# EAGLE design Platine_2_smd (EAGLE 9.6.2)

## Sheet 1 of 2
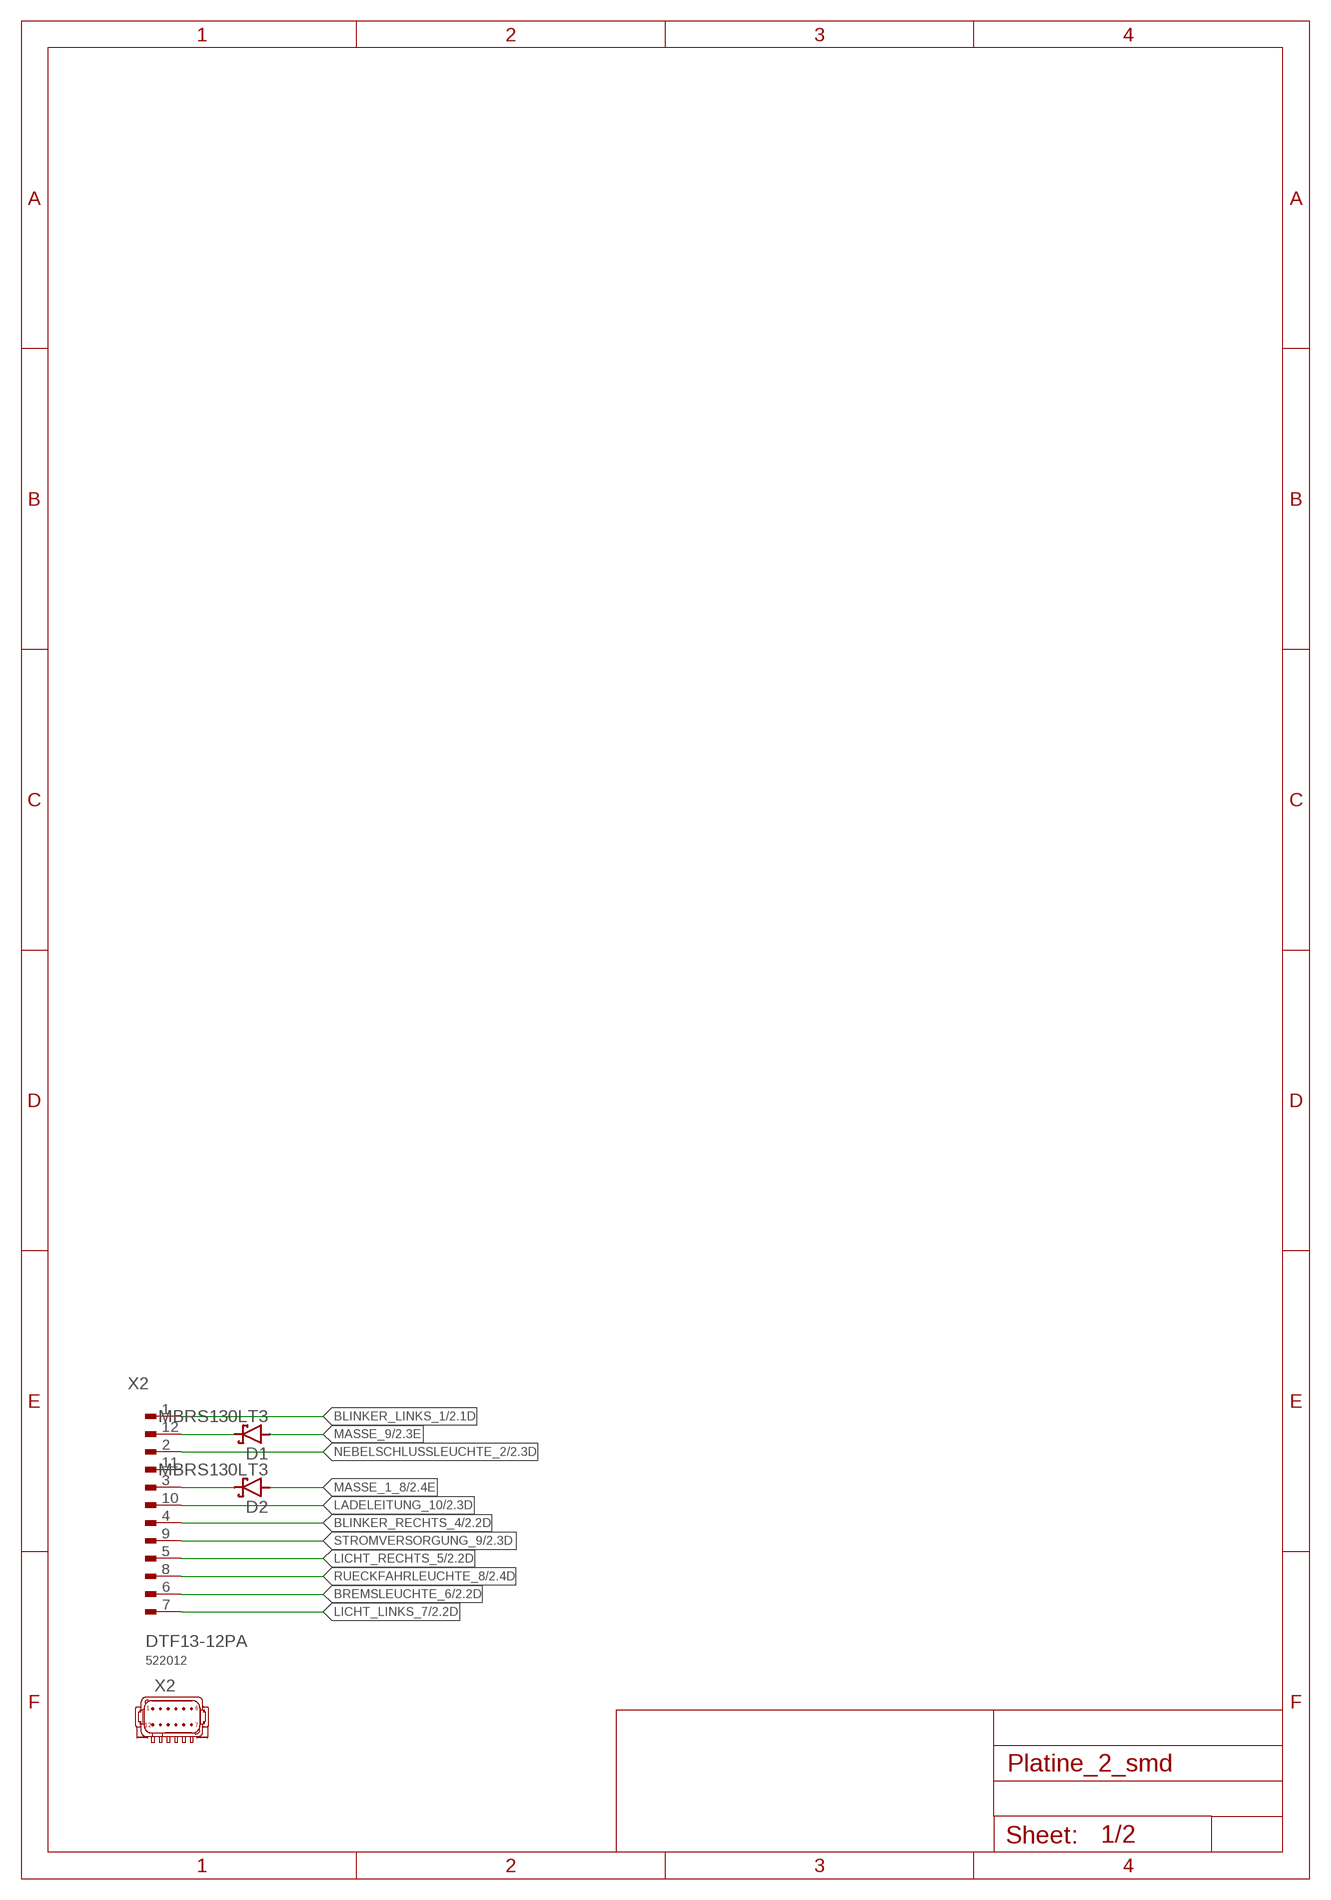
[diagram p0: schematic, sheet 1]

### Parts
D1  MBRS130LT3  [SMB]
D2  MBRS130LT3  [SMB]
X2  DTF13-12PA  [DTF13-12PA]

### Nets
BLINKER_LINKS_1: X2.1 ; also sheet 2
BLINKER_RECHTS_4: X2.4 ; also sheet 2
BREMSLEUCHTE_6: X2.6 ; also sheet 2
LADELEITUNG_10: X2.10 ; also sheet 2
LICHT_LINKS_7: X2.7 ; also sheet 2
LICHT_RECHTS_5: X2.5 ; also sheet 2
MASSE_1_8: D2.A ; also sheet 2
MASSE_9: D1.A ; also sheet 2
N$10: D1.C X2.12
N$11: D2.C X2.3
NEBELSCHLUSSLEUCHTE_2: X2.2 ; also sheet 2
RUECKFAHRLEUCHTE_8: X2.8 ; also sheet 2
STROMVERSORGUNG_9: X2.9 ; also sheet 2
Unconnected: X2.11

## Sheet 2 of 2
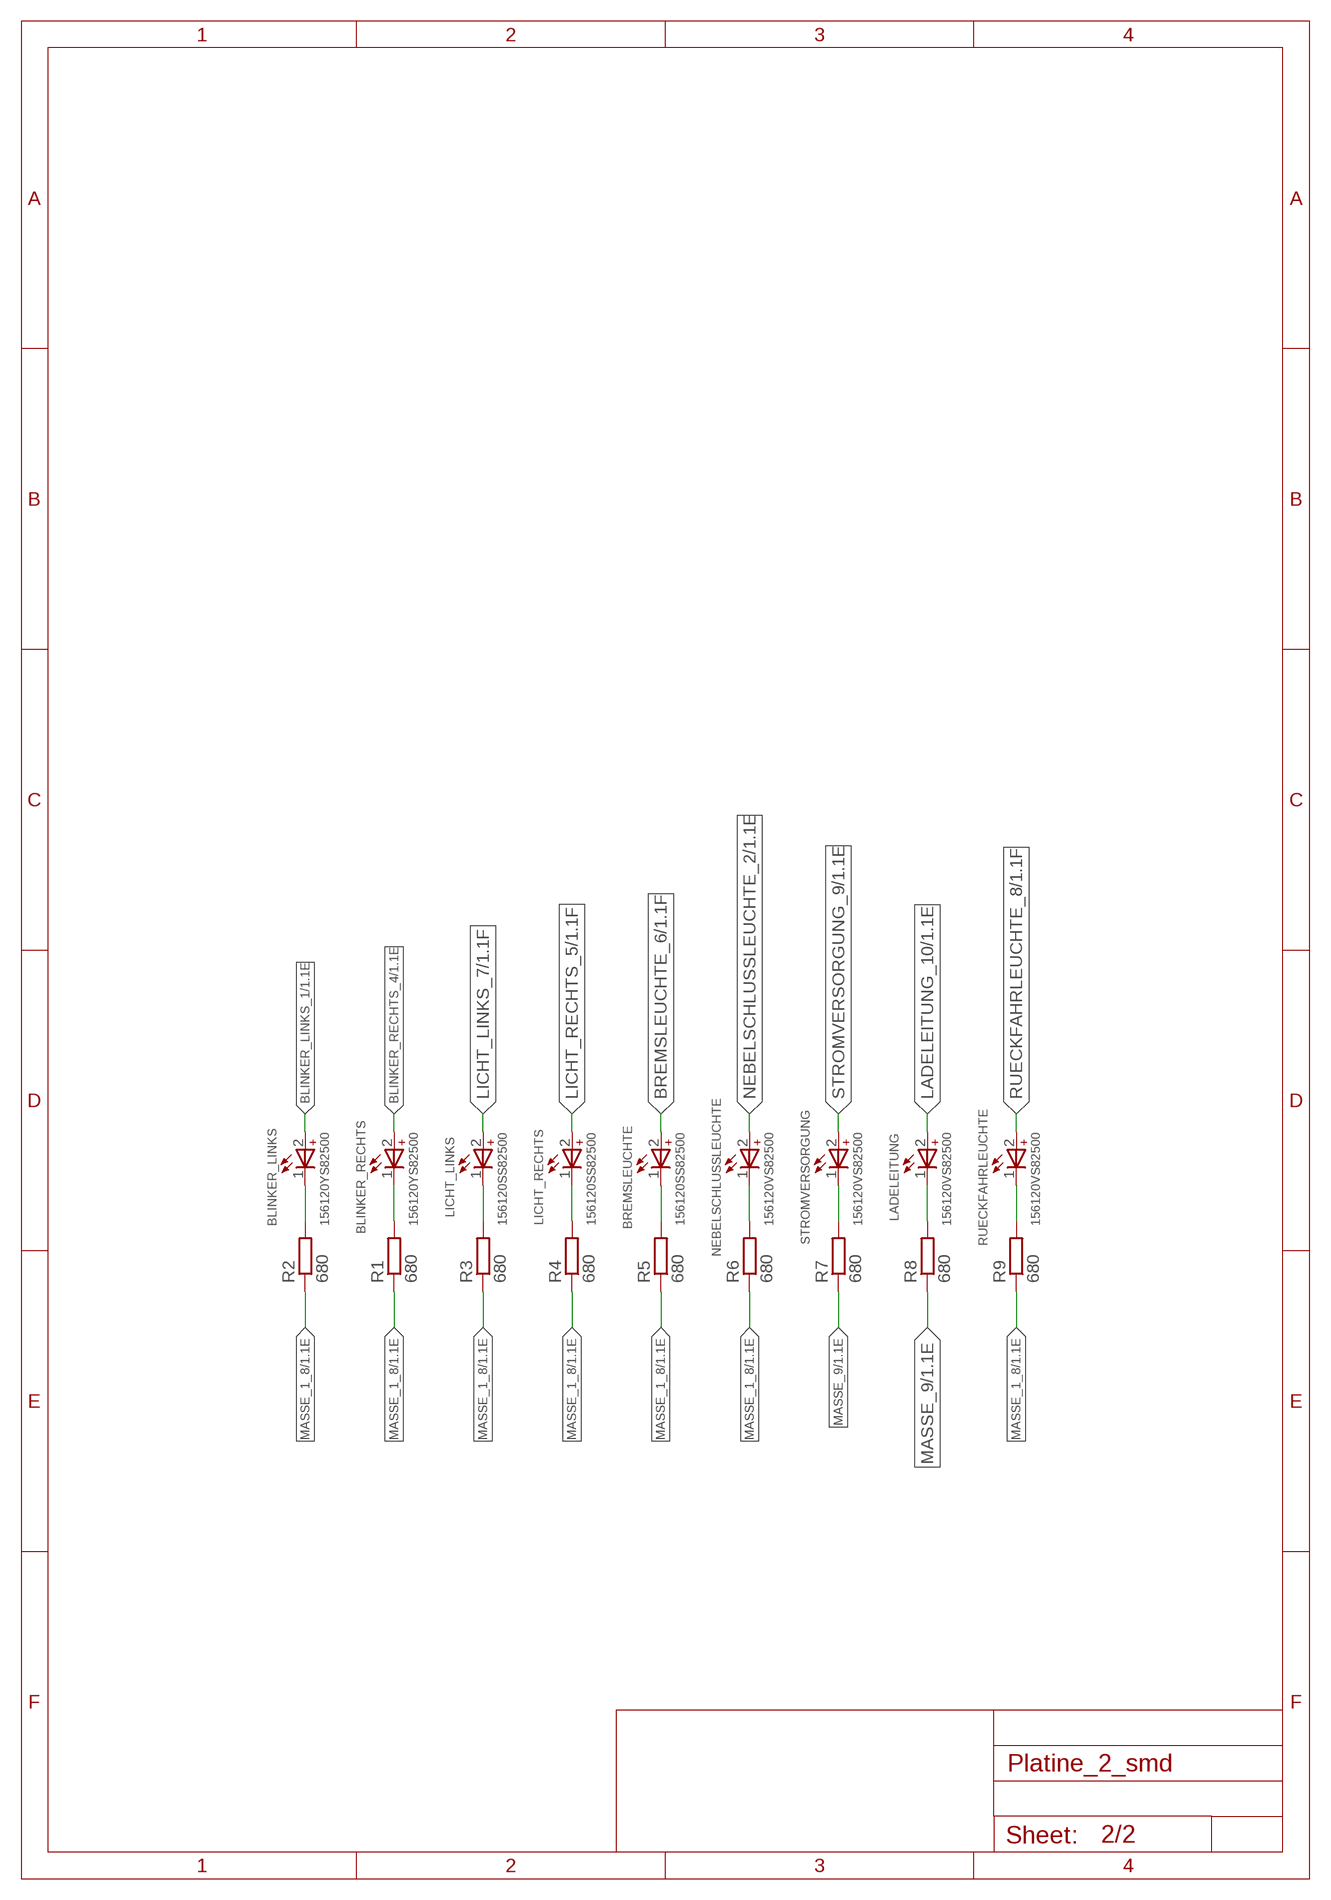
[diagram p1: schematic, sheet 2]

### Parts
BLINKER_LINKS  156120YS82500  WL-SMRW_1206_DOME_156120YS82500_REV  [WL-SMRW_1206_DOME_REV]
BLINKER_RECHTS  156120YS82500  WL-SMRW_1206_DOME_156120YS82500_REV  [WL-SMRW_1206_DOME_REV]
BREMSLEUCHTE  156120SS82500  WL-SMRW_1206_DOME_156120SS82500_REV  [WL-SMRW_1206_DOME_REV]
LADELEITUNG  156120VS82500  WL-SMRW_1206_DOME_156120SS82500_REV  [WL-SMRW_1206_DOME_REV]
LICHT_LINKS  156120SS82500  WL-SMRW_1206_DOME_156120SS82500_REV  [WL-SMRW_1206_DOME_REV]
LICHT_RECHTS  156120SS82500  WL-SMRW_1206_DOME_156120SS82500_REV  [WL-SMRW_1206_DOME_REV]
NEBELSCHLUSSLEUCHTE  156120VS82500  WL-SMRW_1206_DOME_156120SS82500_REV  [WL-SMRW_1206_DOME_REV]
R1  680  R-EU_R1206  [R1206]
R2  680  R-EU_R1206  [R1206]
R3  680  R-EU_R1206  [R1206]
R4  680  R-EU_R1206  [R1206]
R5  680  R-EU_R1206  [R1206]
R6  680  R-EU_R1206  [R1206]
R7  680  R-EU_R1206  [R1206]
R8  680  R-EU_R1206  [R1206]
R9  680  R-EU_R1206  [R1206]
RUECKFAHRLEUCHTE  156120VS82500  WL-SMRW_1206_DOME_156120SS82500_REV  [WL-SMRW_1206_DOME_REV]
STROMVERSORGUNG  156120VS82500  WL-SMRW_1206_DOME_156120SS82500_REV  [WL-SMRW_1206_DOME_REV]

### Nets
BLINKER_LINKS_1: BLINKER_LINKS.2(+) ; also sheet 1
BLINKER_RECHTS_4: BLINKER_RECHTS.2(+) ; also sheet 1
BREMSLEUCHTE_6: BREMSLEUCHTE.2(+) ; also sheet 1
LADELEITUNG_10: LADELEITUNG.2(+) ; also sheet 1
LICHT_LINKS_7: LICHT_LINKS.2(+) ; also sheet 1
LICHT_RECHTS_5: LICHT_RECHTS.2(+) ; also sheet 1
MASSE_1_8: R1.1 R2.1 R3.1 R4.1 R5.1 R6.1 R9.1 ; also sheet 1
MASSE_9: R7.1 R8.1 ; also sheet 1
N$1: LICHT_LINKS.1(-) R3.2
N$2: LICHT_RECHTS.1(-) R4.2
N$3: BLINKER_LINKS.1(-) R2.2
N$4: BREMSLEUCHTE.1(-) R5.2
N$5: BLINKER_RECHTS.1(-) R1.2
N$6: NEBELSCHLUSSLEUCHTE.1(-) R6.2
N$7: R7.2 STROMVERSORGUNG.1(-)
N$8: LADELEITUNG.1(-) R8.2
N$9: R9.2 RUECKFAHRLEUCHTE.1(-)
NEBELSCHLUSSLEUCHTE_2: NEBELSCHLUSSLEUCHTE.2(+) ; also sheet 1
RUECKFAHRLEUCHTE_8: RUECKFAHRLEUCHTE.2(+) ; also sheet 1
STROMVERSORGUNG_9: STROMVERSORGUNG.2(+) ; also sheet 1

## Library data of the parts
BLINKER_LINKS BLINKER_RECHTS = Wurth_LEDs_WL-SMRW:WL-SMRW_1206_DOME: WL-SMRW SMD Mono-color Reverse mount Waterclear Characteristics Small size & thin body for space saving Ideal for narrow space applications Wide viewing angle Low power consumption Industry standard footprint Small LED package for exceptional brightness To emit light through a small cut-out hole in PCB Compatible with automatic placement machine Applications Front panels indicators LCD backlighting Keypad backlighting Push button backlighting Symbol and switch backlighting General LED lighting <https://www.we-online.com/catalog/media/o35733v209%20Family_WL-SMRW_neu.jpg> Details see: www.we-online.com/catalog/WL-SMRW <www.we-online.com/catalog/WL-SMRW/?utm_source=eagle_model&utm_medium=description_link&utm_campaign=eisos_eagle> Updated By Ella Wu 2022-06-20 2022 (C) Wurth Elektronik; CHIP-TECHNOLOGY: AlInGaP; DATASHEET-URL: https://www.we-online.com/redexpert/spec/156120YS82500?ae; DOMINANT-WAVELENGTH: 589nm; EMITTING-COLOR: Yellow; FORWARD-VOLTAGE: 2V; LUMINOUS-INTENSITY: 1400mcd; PART-NUMBER: 156120YS82500; PEAK-WAVELENGTH: 591nm; VIEWING-ANGLE: 20°
BREMSLEUCHTE LICHT_LINKS LICHT_RECHTS = Wurth_LEDs_WL-SMRW:WL-SMRW_1206_DOME: WL-SMRW SMD Mono-color Reverse mount Waterclear Characteristics Small size & thin body for space saving Ideal for narrow space applications Wide viewing angle Low power consumption Industry standard footprint Small LED package for exceptional brightness To emit light through a small cut-out hole in PCB Compatible with automatic placement machine Applications Front panels indicators LCD backlighting Keypad backlighting Push button backlighting Symbol and switch backlighting General LED lighting <https://www.we-online.com/catalog/media/o35733v209%20Family_WL-SMRW_neu.jpg> Details see: www.we-online.com/catalog/WL-SMRW <www.we-online.com/catalog/WL-SMRW/?utm_source=eagle_model&utm_medium=description_link&utm_campaign=eisos_eagle> Updated By Ella Wu 2022-06-20 2022 (C) Wurth Elektronik; CHIP-TECHNOLOGY: AlInGaP; DATASHEET-URL: https://www.we-online.com/redexpert/spec/156120SS82500?ae; DOMINANT-WAVELENGTH: 630nm; EMITTING-COLOR: Super Red; FORWARD-VOLTAGE: 2V; LUMINOUS-INTENSITY: 900mcd; PART-NUMBER: 156120SS82500; PEAK-WAVELENGTH: 645nm; VIEWING-ANGLE: 20°
D1 D2 = diode:MBRS130LT3: Schottky Power Rectifier Source: http://www.onsemi.com/pub/Collateral/MBRS130LT3-D.PDF
LADELEITUNG NEBELSCHLUSSLEUCHTE RUECKFAHRLEUCHTE STROMVERSORGUNG = Wurth_LEDs_WL-SMRW:WL-SMRW_1206_DOME: WL-SMRW SMD Mono-color Reverse mount Waterclear Characteristics Small size & thin body for space saving Ideal for narrow space applications Wide viewing angle Low power consumption Industry standard footprint Small LED package for exceptional brightness To emit light through a small cut-out hole in PCB Compatible with automatic placement machine Applications Front panels indicators LCD backlighting Keypad backlighting Push button backlighting Symbol and switch backlighting General LED lighting <https://www.we-online.com/catalog/media/o35733v209%20Family_WL-SMRW_neu.jpg> Details see: www.we-online.com/catalog/WL-SMRW <www.we-online.com/catalog/WL-SMRW/?utm_source=eagle_model&utm_medium=description_link&utm_campaign=eisos_eagle> Updated By Ella Wu 2022-06-20 2022 (C) Wurth Elektronik; CHIP-TECHNOLOGY: AlInGaP; DATASHEET-URL: https://www.we-online.com/redexpert/spec/156120SS82500?ae; DOMINANT-WAVELENGTH: 630nm; EMITTING-COLOR: Super Red; FORWARD-VOLTAGE: 2V; LUMINOUS-INTENSITY: 900mcd; PART-NUMBER: 156120SS82500; PEAK-WAVELENGTH: 645nm; VALUE: 156120SS82500; VIEWING-ANGLE: 20°
R1-R9 = rcl:R-EU_: RESISTOR, European symbol; SPICEPREFIX: R
X2 = DEUTSCH-PCB:DTF13-12PA: DTF13-12PA Connector System : Draht-an-Leiterplatte, Kabel-an-Gerät Alias NummerZPF000000000130557 Home-Page <http://www.te.com/deu-de/product-DTF13-12PA.html>; ARTIKEL_NR: 522012

## Board
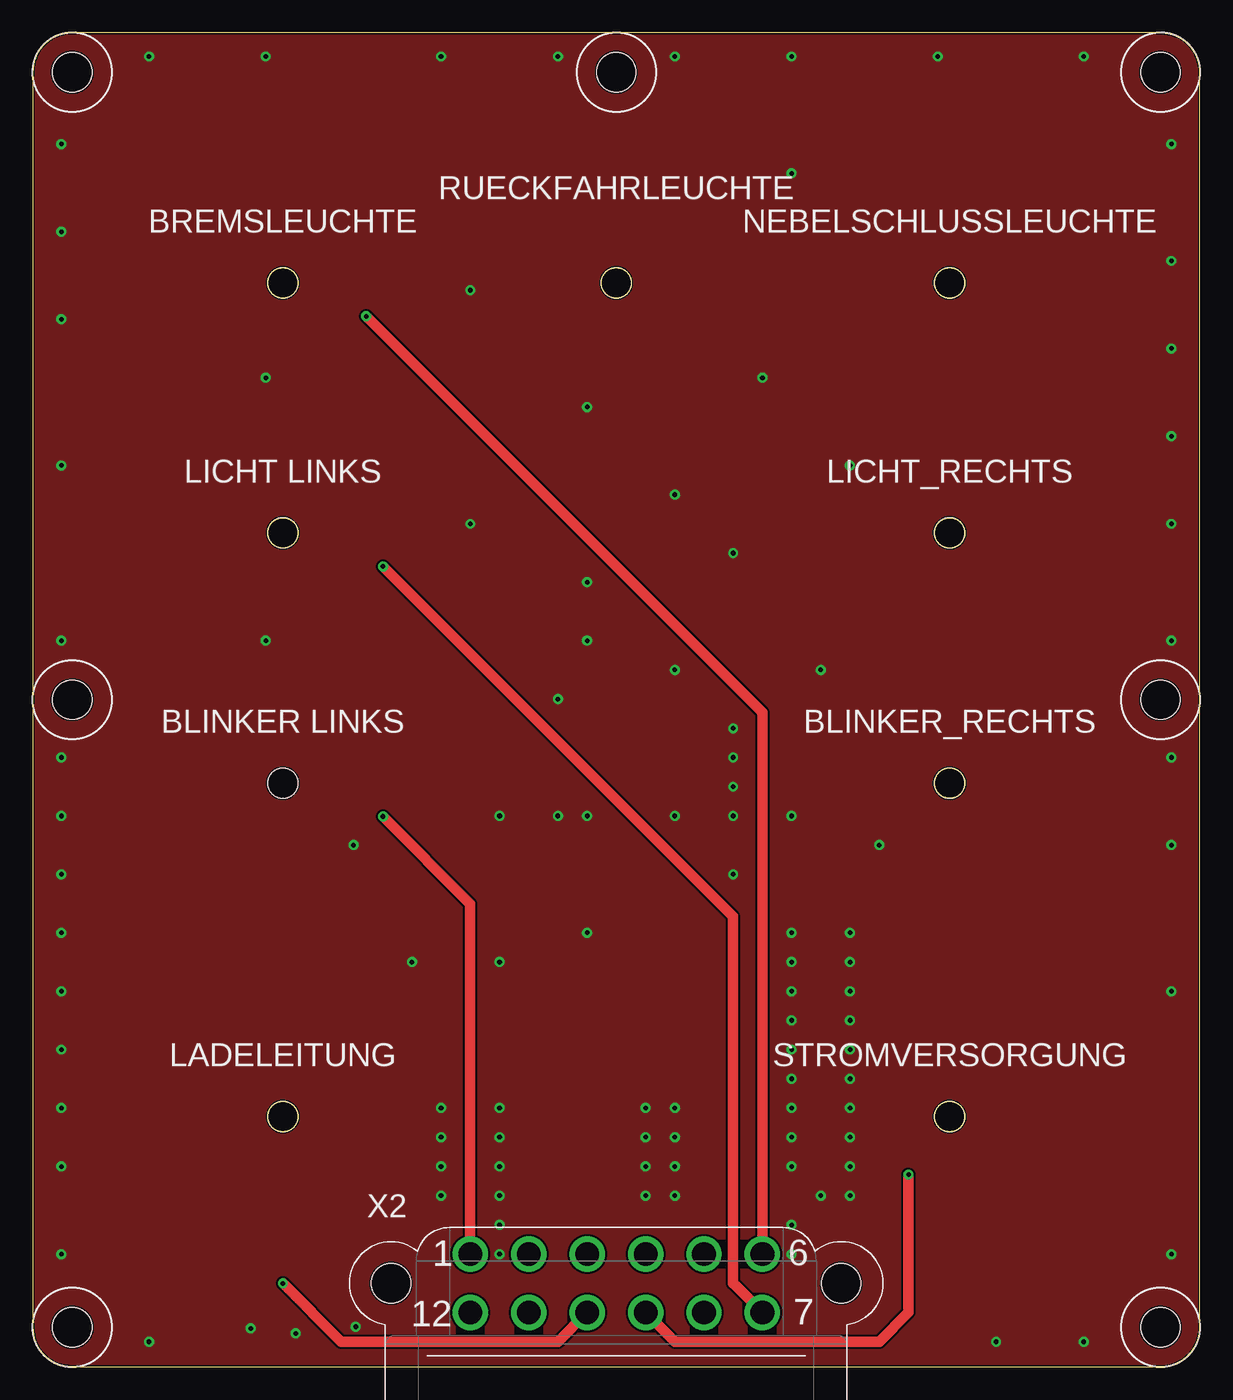
[diagram p2: board, top side]
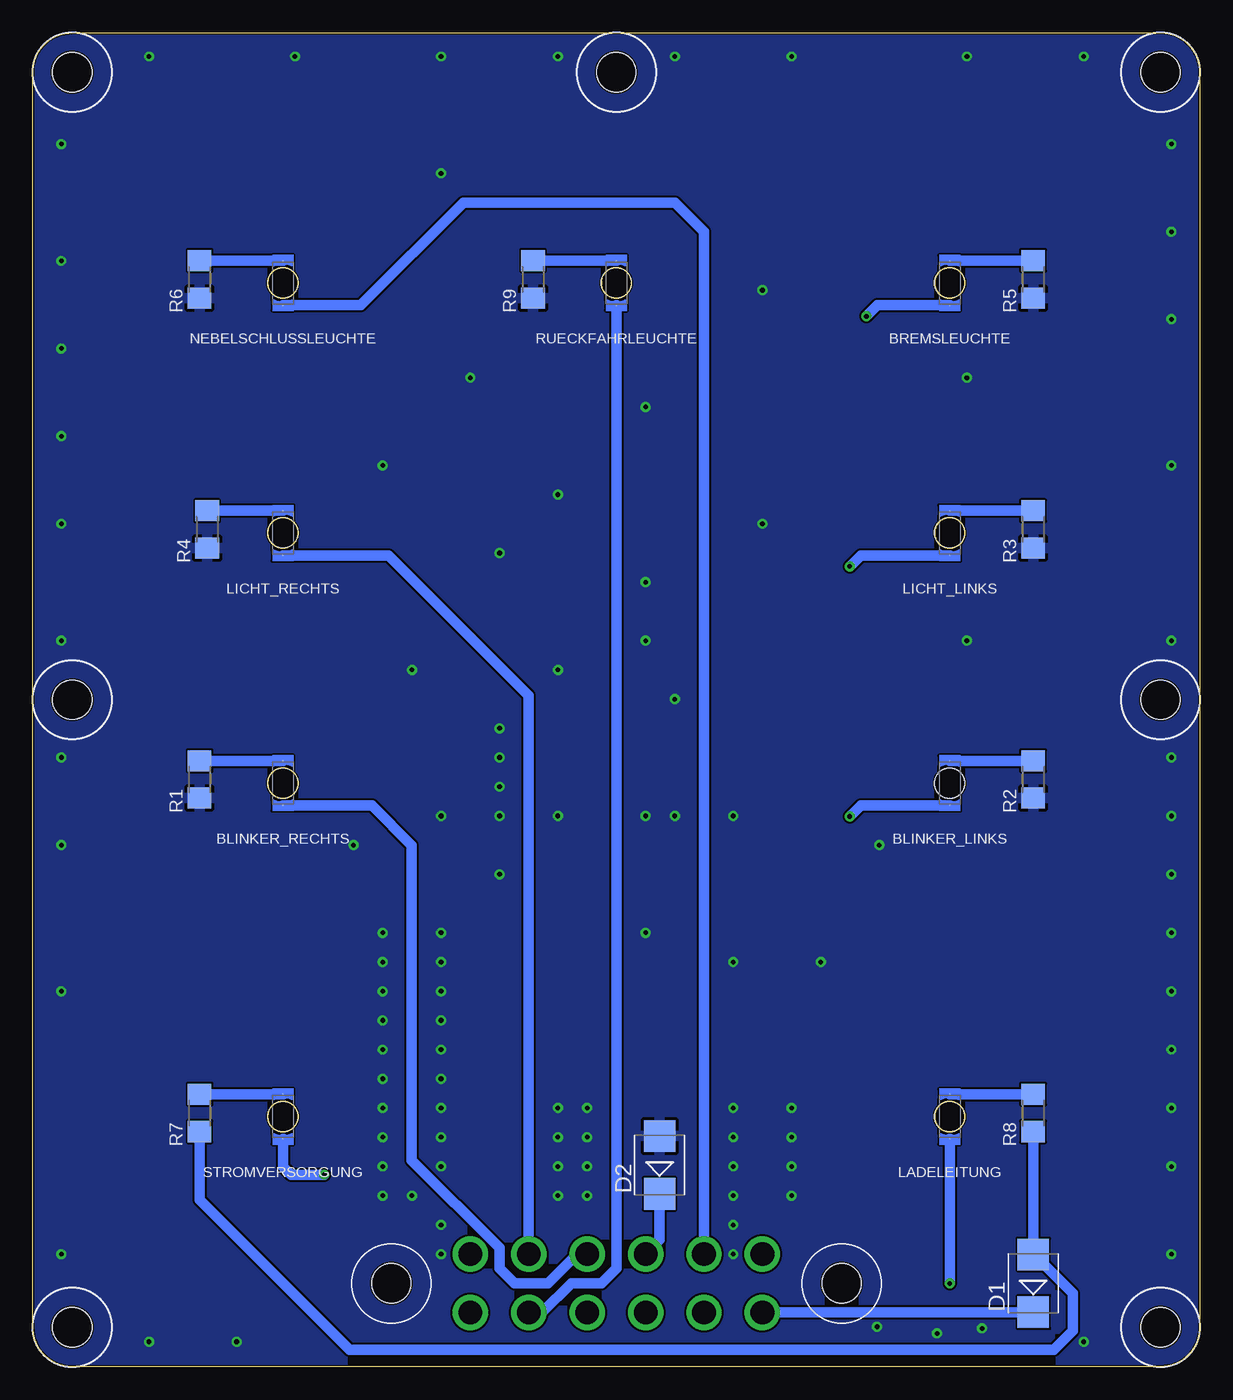
[diagram p3: board, bottom side, seen from below]

Size 88.9 x 101.6 mm. Coordinates in mm from the lower left corner, seen from the top.
Outline: 69.9,81.4 69.81,81.4 69.72,81.41 69.62,81.42 69.54,81.44 69.45,81.47 69.37,81.5 69.29,81.55 69.21,81.59 69.14,81.65 69.07,81.7 69,81.77 68.95,81.84 68.89,81.91 68.85,81.99 68.81,82.07 68.77,82.15 68.74,82.24 68.72,82.32 68.71,82.41 68.7,82.5 68.7,82.59 68.71,82.68 68.72,82.77 68.74,82.86 68.77,82.95 68.81,83.03 68.85,83.11 68.89,83.19 68.95,83.26 69,83.33 69.07,83.39 69.14,83.45 69.21,83.51 69.29,83.55 69.37,83.59 69.45,83.63 69.54,83.66 69.62,83.68 69.72,83.69 69.81,83.7 69.9,83.7 69.98,83.69 70.08,83.68 70.16,83.66 70.25,83.63 70.33,83.59 70.41,83.55 70.49,83.51 70.56,83.45 70.63,83.39 70.7,83.33 70.75,83.26 70.81,83.19 70.85,83.11 70.9,83.03 70.93,82.95 70.96,82.86 70.98,82.77 70.99,82.68 71,82.59 71,82.5 70.99,82.41 70.98,82.32 70.96,82.24 70.93,82.15 70.9,82.07 70.85,81.99 70.81,81.91 70.75,81.84 70.7,81.77 70.63,81.7 70.56,81.65 70.49,81.59 70.41,81.55 70.33,81.5 70.25,81.47 70.16,81.44 70.08,81.42 69.98,81.41 69.9,81.4
Outline: 69.9,43.3 69.81,43.3 69.72,43.31 69.62,43.32 69.54,43.34 69.45,43.37 69.37,43.41 69.29,43.45 69.21,43.49 69.14,43.55 69.07,43.61 69,43.67 68.95,43.74 68.89,43.81 68.85,43.89 68.81,43.97 68.77,44.05 68.74,44.14 68.72,44.23 68.71,44.32 68.7,44.41 68.7,44.5 68.71,44.59 68.72,44.68 68.74,44.76 68.77,44.85 68.81,44.93 68.85,45.01 68.89,45.09 68.95,45.16 69,45.23 69.07,45.3 69.14,45.35 69.21,45.41 69.29,45.45 69.37,45.5 69.45,45.53 69.54,45.56 69.62,45.58 69.72,45.59 69.81,45.6 69.9,45.6 69.98,45.59 70.08,45.58 70.16,45.56 70.25,45.53 70.33,45.5 70.41,45.45 70.49,45.41 70.56,45.35 70.63,45.3 70.7,45.23 70.75,45.16 70.81,45.09 70.85,45.01 70.9,44.93 70.93,44.85 70.96,44.76 70.98,44.68 70.99,44.59 71,44.5 71,44.41 70.99,44.32 70.98,44.23 70.96,44.14 70.93,44.05 70.9,43.97 70.85,43.89 70.81,43.81 70.75,43.74 70.7,43.67 70.63,43.61 70.56,43.55 70.49,43.49 70.41,43.45 70.33,43.41 70.25,43.37 70.16,43.34 70.08,43.32 69.98,43.31 69.9,43.3
Outline: 19.1,17.9 19.01,17.9 18.92,17.91 18.83,17.92 18.74,17.94 18.65,17.97 18.57,18 18.49,18.05 18.41,18.09 18.34,18.15 18.27,18.2 18.21,18.27 18.15,18.34 18.09,18.41 18.05,18.49 18.01,18.57 17.97,18.65 17.94,18.74 17.92,18.83 17.91,18.91 17.9,19 17.9,19.09 17.91,19.19 17.92,19.27 17.94,19.36 17.97,19.45 18.01,19.53 18.05,19.61 18.09,19.69 18.15,19.76 18.21,19.83 18.27,19.89 18.34,19.95 18.41,20.01 18.49,20.05 18.57,20.09 18.65,20.13 18.74,20.16 18.83,20.18 18.92,20.19 19.01,20.2 19.1,20.2 19.19,20.19 19.28,20.18 19.36,20.16 19.45,20.13 19.53,20.09 19.61,20.05 19.69,20.01 19.76,19.95 19.83,19.89 19.9,19.83 19.95,19.76 20.01,19.69 20.05,19.61 20.1,19.53 20.13,19.45 20.16,19.36 20.18,19.27 20.19,19.19 20.2,19.09 20.2,19 20.19,18.91 20.18,18.83 20.16,18.74 20.13,18.65 20.1,18.57 20.05,18.49 20.01,18.41 19.95,18.34 19.9,18.27 19.83,18.2 19.76,18.15 19.69,18.09 19.61,18.05 19.53,18 19.45,17.97 19.36,17.94 19.28,17.92 19.19,17.91 19.1,17.9
Outline: 19.1,81.4 19.01,81.4 18.92,81.41 18.83,81.42 18.74,81.44 18.65,81.47 18.57,81.5 18.49,81.55 18.41,81.59 18.34,81.65 18.27,81.7 18.21,81.77 18.15,81.84 18.09,81.91 18.05,81.99 18.01,82.07 17.97,82.15 17.94,82.24 17.92,82.32 17.91,82.41 17.9,82.5 17.9,82.59 17.91,82.68 17.92,82.77 17.94,82.86 17.97,82.95 18.01,83.03 18.05,83.11 18.09,83.19 18.15,83.26 18.21,83.33 18.27,83.39 18.34,83.45 18.41,83.51 18.49,83.55 18.57,83.59 18.65,83.63 18.74,83.66 18.83,83.68 18.92,83.69 19.01,83.7 19.1,83.7 19.19,83.69 19.28,83.68 19.36,83.66 19.45,83.63 19.53,83.59 19.61,83.55 19.69,83.51 19.76,83.45 19.83,83.39 19.9,83.33 19.95,83.26 20.01,83.19 20.05,83.11 20.1,83.03 20.13,82.95 20.16,82.86 20.18,82.77 20.19,82.68 20.2,82.59 20.2,82.5 20.19,82.41 20.18,82.32 20.16,82.24 20.13,82.15 20.1,82.07 20.05,81.99 20.01,81.91 19.95,81.84 19.9,81.77 19.83,81.7 19.76,81.65 19.69,81.59 19.61,81.55 19.53,81.5 19.45,81.47 19.36,81.44 19.28,81.42 19.19,81.41 19.1,81.4
Outline: 69.9,17.9 69.81,17.9 69.72,17.91 69.62,17.92 69.54,17.94 69.45,17.97 69.37,18 69.29,18.05 69.21,18.09 69.14,18.15 69.07,18.2 69,18.27 68.95,18.34 68.89,18.41 68.85,18.49 68.81,18.57 68.77,18.65 68.74,18.74 68.72,18.83 68.71,18.91 68.7,19 68.7,19.09 68.71,19.19 68.72,19.27 68.74,19.36 68.77,19.45 68.81,19.53 68.85,19.61 68.89,19.69 68.95,19.76 69,19.83 69.07,19.89 69.14,19.95 69.21,20.01 69.29,20.05 69.37,20.09 69.45,20.13 69.54,20.16 69.62,20.18 69.72,20.19 69.81,20.2 69.9,20.2 69.98,20.19 70.08,20.18 70.16,20.16 70.25,20.13 70.33,20.09 70.41,20.05 70.49,20.01 70.56,19.95 70.63,19.89 70.7,19.83 70.75,19.76 70.81,19.69 70.85,19.61 70.9,19.53 70.93,19.45 70.96,19.36 70.98,19.27 70.99,19.19 71,19.09 71,19 70.99,18.91 70.98,18.83 70.96,18.74 70.93,18.65 70.9,18.57 70.85,18.49 70.81,18.41 70.75,18.34 70.7,18.27 70.63,18.2 70.56,18.15 70.49,18.09 70.41,18.05 70.33,18 70.25,17.97 70.16,17.94 70.08,17.92 69.98,17.91 69.9,17.9
Outline: 44.5,81.4 44.41,81.4 44.32,81.41 44.23,81.42 44.14,81.44 44.05,81.47 43.97,81.5 43.89,81.55 43.81,81.59 43.74,81.65 43.67,81.7 43.61,81.77 43.55,81.84 43.49,81.91 43.45,81.99 43.41,82.07 43.37,82.15 43.34,82.24 43.32,82.32 43.31,82.41 43.3,82.5 43.3,82.59 43.31,82.68 43.32,82.77 43.34,82.86 43.37,82.95 43.41,83.03 43.45,83.11 43.49,83.19 43.55,83.26 43.61,83.33 43.67,83.39 43.74,83.45 43.81,83.51 43.89,83.55 43.97,83.59 44.05,83.63 44.14,83.66 44.23,83.68 44.32,83.69 44.41,83.7 44.5,83.7 44.59,83.69 44.68,83.68 44.76,83.66 44.85,83.63 44.93,83.59 45.01,83.55 45.09,83.51 45.16,83.45 45.23,83.39 45.3,83.33 45.35,83.26 45.41,83.19 45.45,83.11 45.5,83.03 45.53,82.95 45.56,82.86 45.58,82.77 45.59,82.68 45.6,82.59 45.6,82.5 45.59,82.41 45.58,82.32 45.56,82.24 45.53,82.15 45.5,82.07 45.45,81.99 45.41,81.91 45.35,81.84 45.3,81.77 45.23,81.7 45.16,81.65 45.09,81.59 45.01,81.55 44.93,81.5 44.85,81.47 44.76,81.44 44.68,81.42 44.59,81.41 44.5,81.4
Outline: 69.9,62.35 69.81,62.35 69.72,62.36 69.62,62.37 69.54,62.39 69.45,62.42 69.37,62.45 69.29,62.5 69.21,62.54 69.14,62.6 69.07,62.66 69,62.72 68.95,62.79 68.89,62.86 68.85,62.94 68.81,63.02 68.77,63.1 68.74,63.19 68.72,63.27 68.71,63.37 68.7,63.45 68.7,63.55 68.71,63.63 68.72,63.72 68.74,63.81 68.77,63.9 68.81,63.98 68.85,64.06 68.89,64.14 68.95,64.21 69,64.28 69.07,64.34 69.14,64.4 69.21,64.46 69.29,64.5 69.37,64.55 69.45,64.58 69.54,64.61 69.62,64.63 69.72,64.64 69.81,64.65 69.9,64.65 69.98,64.64 70.08,64.63 70.16,64.61 70.25,64.58 70.33,64.55 70.41,64.5 70.49,64.46 70.56,64.4 70.63,64.34 70.7,64.28 70.75,64.21 70.81,64.14 70.85,64.06 70.9,63.98 70.93,63.9 70.96,63.81 70.98,63.72 70.99,63.63 71,63.55 71,63.45 70.99,63.37 70.98,63.27 70.96,63.19 70.93,63.1 70.9,63.02 70.85,62.94 70.81,62.86 70.75,62.79 70.7,62.72 70.63,62.66 70.56,62.6 70.49,62.54 70.41,62.5 70.33,62.45 70.25,62.42 70.16,62.39 70.08,62.37 69.98,62.36 69.9,62.35
Outline: 19.1,62.35 19.01,62.35 18.92,62.36 18.83,62.37 18.74,62.39 18.65,62.42 18.57,62.45 18.49,62.5 18.41,62.54 18.34,62.6 18.27,62.66 18.21,62.72 18.15,62.79 18.09,62.86 18.05,62.94 18.01,63.02 17.97,63.1 17.94,63.19 17.92,63.27 17.91,63.37 17.9,63.45 17.9,63.55 17.91,63.63 17.92,63.72 17.94,63.81 17.97,63.9 18.01,63.98 18.05,64.06 18.09,64.14 18.15,64.21 18.21,64.28 18.27,64.34 18.34,64.4 18.41,64.46 18.49,64.5 18.57,64.55 18.65,64.58 18.74,64.61 18.83,64.63 18.92,64.64 19.01,64.65 19.1,64.65 19.19,64.64 19.28,64.63 19.36,64.61 19.45,64.58 19.53,64.55 19.61,64.5 19.69,64.46 19.76,64.4 19.83,64.34 19.9,64.28 19.95,64.21 20.01,64.14 20.05,64.06 20.1,63.98 20.13,63.9 20.16,63.81 20.18,63.72 20.19,63.63 20.2,63.55 20.2,63.45 20.19,63.37 20.18,63.27 20.16,63.19 20.13,63.1 20.1,63.02 20.05,62.94 20.01,62.86 19.95,62.79 19.9,62.72 19.83,62.66 19.76,62.6 19.69,62.54 19.61,62.5 19.53,62.45 19.45,62.42 19.36,62.39 19.28,62.37 19.19,62.36 19.1,62.35
Outline: 0,98.6 0,3 arc90 3,0 85.9,0 86.16,0.01 arc85 88.9,3 88.9,98.6 88.89,98.86 arc85 85.9,101.6 3,101.6 2.74,101.59 arc85 0,98.6
Copper layers (1*16): Top 0.035mm / dielectric 1.5mm / Bottom 0.035mm
Design rules "default *": minimum track width 6mil, minimum drill 0.35mm, track to track 6mil, track to pad 6mil, pad to pad 6mil, via to via 6mil, smd to smd 6mil, copper to edge 5mil, drill to drill 6mil, minimum pad ring 10mil, minimum via ring 8mil, stop-mask expansion 4mil, vias tented up to drill 100mil, thermal gap 10mil
Holes 3 mm at 27.29,6.35 61.58,6.35 3,98.6 85.9,98.6 85.9,3 3,3 44.45,98.6 85.9,50.8 3,50.8
Holes 2.3 mm at 19.05,63.5 69.85,63.5 19.05,82.55 19.05,44.45 69.85,44.45 69.85,82.55 69.85,19.05 19.05,19.05 44.45,82.55

### Footprints (pad centres in the part's own frame; a part is rotated, then mirrored left to right if it is on the bottom)
WL-SMRW_1206_DOME_REV = smd 0.1 x 0.1: 1 -1.7,0; 2 1.7,0; 3 1.7,0 | hole 2.3: 0,0
SMB = smd 2.4 x 2.4: A 2.2,0; C -2.2,0
R1206 = smd 1.6 x 1.803: 1 -1.422,0; 2 1.422,0
DTF13-12PA = drill 1.8 pad 2.4: 1 -11.125,2.223; 2 -6.675,2.223; 3 -2.225,2.223; 4 2.225,2.223; 5 6.675,2.223; 6 11.125,2.223; 7 11.125,-2.223; 8 6.675,-2.223; 9 2.225,-2.223; 10 -2.225,-2.223; 11 -6.675,-2.223; 12 -11.125,-2.223 | hole 3: -17.157,0; 17.133,0

### Placement (x,y rotation side)
BLINKER_LINKS  19.05,44.45 270 bottom
BLINKER_RECHTS  69.85,44.45 270 bottom
BREMSLEUCHTE  19.05,82.55 270 bottom
D1  12.7,6.35 90 bottom
D2  41.15,15.37 90 bottom
LADELEITUNG  19.05,19.05 270 bottom
LICHT_LINKS  19.05,63.5 270 bottom
LICHT_RECHTS  69.85,63.5 270 bottom
NEBELSCHLUSSLEUCHTE  69.85,82.55 270 bottom
R1  76.2,44.73 90 bottom
R2  12.7,44.73 90 bottom
R3  12.7,63.78 90 bottom
R4  75.62,63.78 90 bottom
R5  12.7,82.83 90 bottom
R6  76.2,82.83 90 bottom
R7  76.2,19.33 90 bottom
R8  12.7,19.33 90 bottom
R9  50.8,82.83 90 bottom
RUECKFAHRLEUCHTE  44.45,82.55 270 bottom
STROMVERSORGUNG  69.85,19.05 270 bottom
X2  44.45,6.35 0 top

### Tracks (layer width: path | path; a pad name or v marks a point on that pad's centre or on a via)
BLINKER_LINKS_1  (via drill 0.35)
  Top 0.813: v26.67,41.91 33.33,35.26 X2.1
  Bottom 0.813: BLINKER_LINKS.2 25.83,42.75 v26.67,41.91
BLINKER_RECHTS_4
  Bottom 0.813: X2.4 47.44,8.57 49.66,6.35 52.2,6.35 53.35,7.5 53.35,9.05 60.04,15.73 60.04,39.72 63.07,42.75 BLINKER_RECHTS.2
BREMSLEUCHTE_6  (via drill 0.35)
  Top 0.813: v25.4,80.01 55.58,49.84 X2.6
  Bottom 0.813: BREMSLEUCHTE.2 24.56,80.85 v25.4,80.01
LADELEITUNG_10  (via drill 0.35)
  Top 0.813: X2.10 40,1.9 23.49,1.9 v19.05,6.34
  Bottom 0.813: LADELEITUNG.2 v19.05,6.34
LICHT_LINKS_7  (via drill 0.35)
  Top 0.813: X2.7 53.35,6.35 53.35,34.28 v26.67,60.96
  Bottom 0.813: LICHT_LINKS.2 25.83,61.8 v26.67,60.96
LICHT_RECHTS_5
  Bottom 0.813: X2.5 51.12,51.12 61.8,61.8 LICHT_RECHTS.2
MASSE_1_8  (via drill 0.35)
  other vias: 48.9,17.48 48.9,19.7 46.68,19.7 35.55,19.7 35.55,17.48 35.55,15.25 35.55,13.02 35.55,10.8 35.55,8.57 31.1,19.7 31.1,17.48 31.1,15.25 31.1,13.02 46.68,13.02 60.03,13.02 57.8,10.8 57.8,8.57 57.8,19.7 62.25,19.7 62.25,17.48 62.25,15.25 62.25,13.02 57.8,33.05 57.8,30.83 57.8,28.6 57.8,26.38 57.8,24.15 57.8,21.92 62.25,21.92 62.25,24.15 62.25,26.38 62.25,28.6 62.25,30.83 62.25,33.05 57.8,17.48 57.8,15.25 48.9,15.25 48.9,13.02 46.68,15.25 46.68,17.48 53.35,37.5 53.35,48.62 53.35,46.4 53.35,44.18 53.35,41.95 57.8,41.95 64.47,39.73 48.9,41.95 42.23,41.95 40,41.95 35.55,41.95 24.43,39.73 2.18,8.57 2.18,46.4 8.85,1.9 80.05,1.9 86.72,8.57 86.72,46.4 86.72,55.3 86.72,93.12 80.05,99.8 48.9,99.8 40,99.8 8.85,99.8 2.18,93.12 2.18,55.3 2.18,41.95 2.18,37.5 2.18,33.05 2.18,28.6 2.18,24.15 2.18,19.7 2.18,15.25 2.18,86.45 2.18,79.77 2.18,68.65 17.75,99.8 31.1,99.8 68.93,99.8 57.8,99.8 86.72,84.22 86.72,77.55 86.72,70.88 86.72,64.2 86.72,39.73 86.72,28.6 73.38,1.9 42.23,73.1 55.58,75.32 17.75,75.32 33.33,82 17.75,55.3 33.33,64.2 42.23,55.3 42.23,59.75 40,50.85 48.9,53.08 53.35,61.98 48.9,66.42 60.03,53.08 62.25,68.65 57.8,90.9 42.23,33.05 28.88,30.83 35.55,30.83 16.6,2.92 24.6,3.04 20.03,2.53
  pour Top: -6.35,107.95 95.25,107.95 95.25,-3.81 -6.35,-3.81
  pour Bottom: -6.35,107.95 95.25,107.95 95.25,-3.81 -6.35,-3.81
MASSE_9
  Bottom 0.813: R8.1 D1.A 12.64,8.55 9.67,5.58 9.67,2.72 11.12,1.27 64.77,1.27 76.2,12.7 R7.1
N$1
  Bottom 0.813: LICHT_LINKS.1 R3.2
N$2
  Bottom 0.813: LICHT_RECHTS.1 R4.2
N$3
  Bottom 0.813: BLINKER_LINKS.1 R2.2
N$4
  Bottom 0.813: BREMSLEUCHTE.1 R5.2
N$5
  Bottom 0.813: BLINKER_RECHTS.1 R1.2
N$6
  Bottom 0.813: NEBELSCHLUSSLEUCHTE.1 R6.2
N$7
  Bottom 0.813: STROMVERSORGUNG.1 R7.2
N$8
  Bottom 0.813: LADELEITUNG.1 R8.2
N$9
  Bottom 0.813: RUECKFAHRLEUCHTE.1 R9.2
N$10
  Bottom 0.813: X2.12 12.72,4.13 D1.C
N$11
  Bottom 0.813: X2.3 41.15,9.65 D2.C
NEBELSCHLUSSLEUCHTE_2
  Bottom 0.813: X2.2 37.78,86.45 40,88.67 56.11,88.67 63.93,80.85 NEBELSCHLUSSLEUCHTE.2
RUECKFAHRLEUCHTE_8
  Bottom 0.813: X2.8 50.11,4.13 47.88,6.35 45.59,6.35 44.45,7.49 RUECKFAHRLEUCHTE.2
STROMVERSORGUNG_9  (via drill 0.35)
  Top 0.813: v66.7,14.63 66.7,4.12 64.47,1.9 48.9,1.9 X2.9
  Bottom 0.813: STROMVERSORGUNG.2 69.85,15.24 69.24,14.63 v66.7,14.63

### Text on the board
tPlace: RUECKFAHRLEUCHTE | BREMSLEUCHTE | NEBELSCHLUSSLEUCHTE | LICHT LINKS | LICHT_RECHTS | BLINKER LINKS | BLINKER_RECHTS | LADELEITUNG | STROMVERSORGUNG